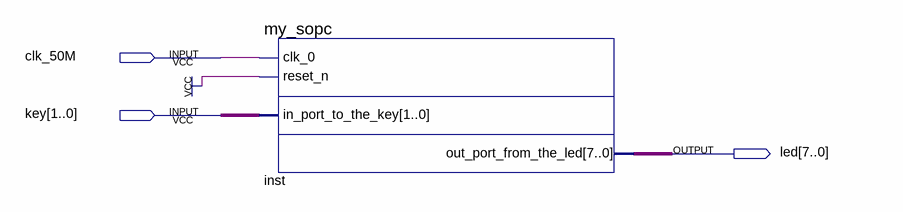
[diagram p0: schematic sheet]
// Quartus schematic sopc_compteur.bdf as structural Verilog: 1 symbols, 3 pins
module sopc_compteur (
  input  clk_50M,
  input  [1:0] key,
  output [7:0] led
);

  my_sopc inst (.clk_0(clk_50M), .reset_n(1'b1), .in_port_to_the_key(key), .out_port_from_the_led(led));
endmodule
